# Altium project 110-00315-D_B1-DevKit_1.PrjPcb (part 4 of 5)

## Sheet 12-JLINK_1.SchDoc: B1 DevKit (DK-B1)
size 431 x 279 mm; Organization: ORGANIZATION; Address1: ADDRESS 1; Address2: ADDRESS 2; Address3: ADDRESS 3; Address4: ADDRESS 4; DocumentNumber: 12; Revision: -; SheetNumber: 12; SheetTotal: 14; ENG_APP_DATE: --/--/--; DSN_APP_DATE: --/--/--; CHK_APP_DATE: --/--/--
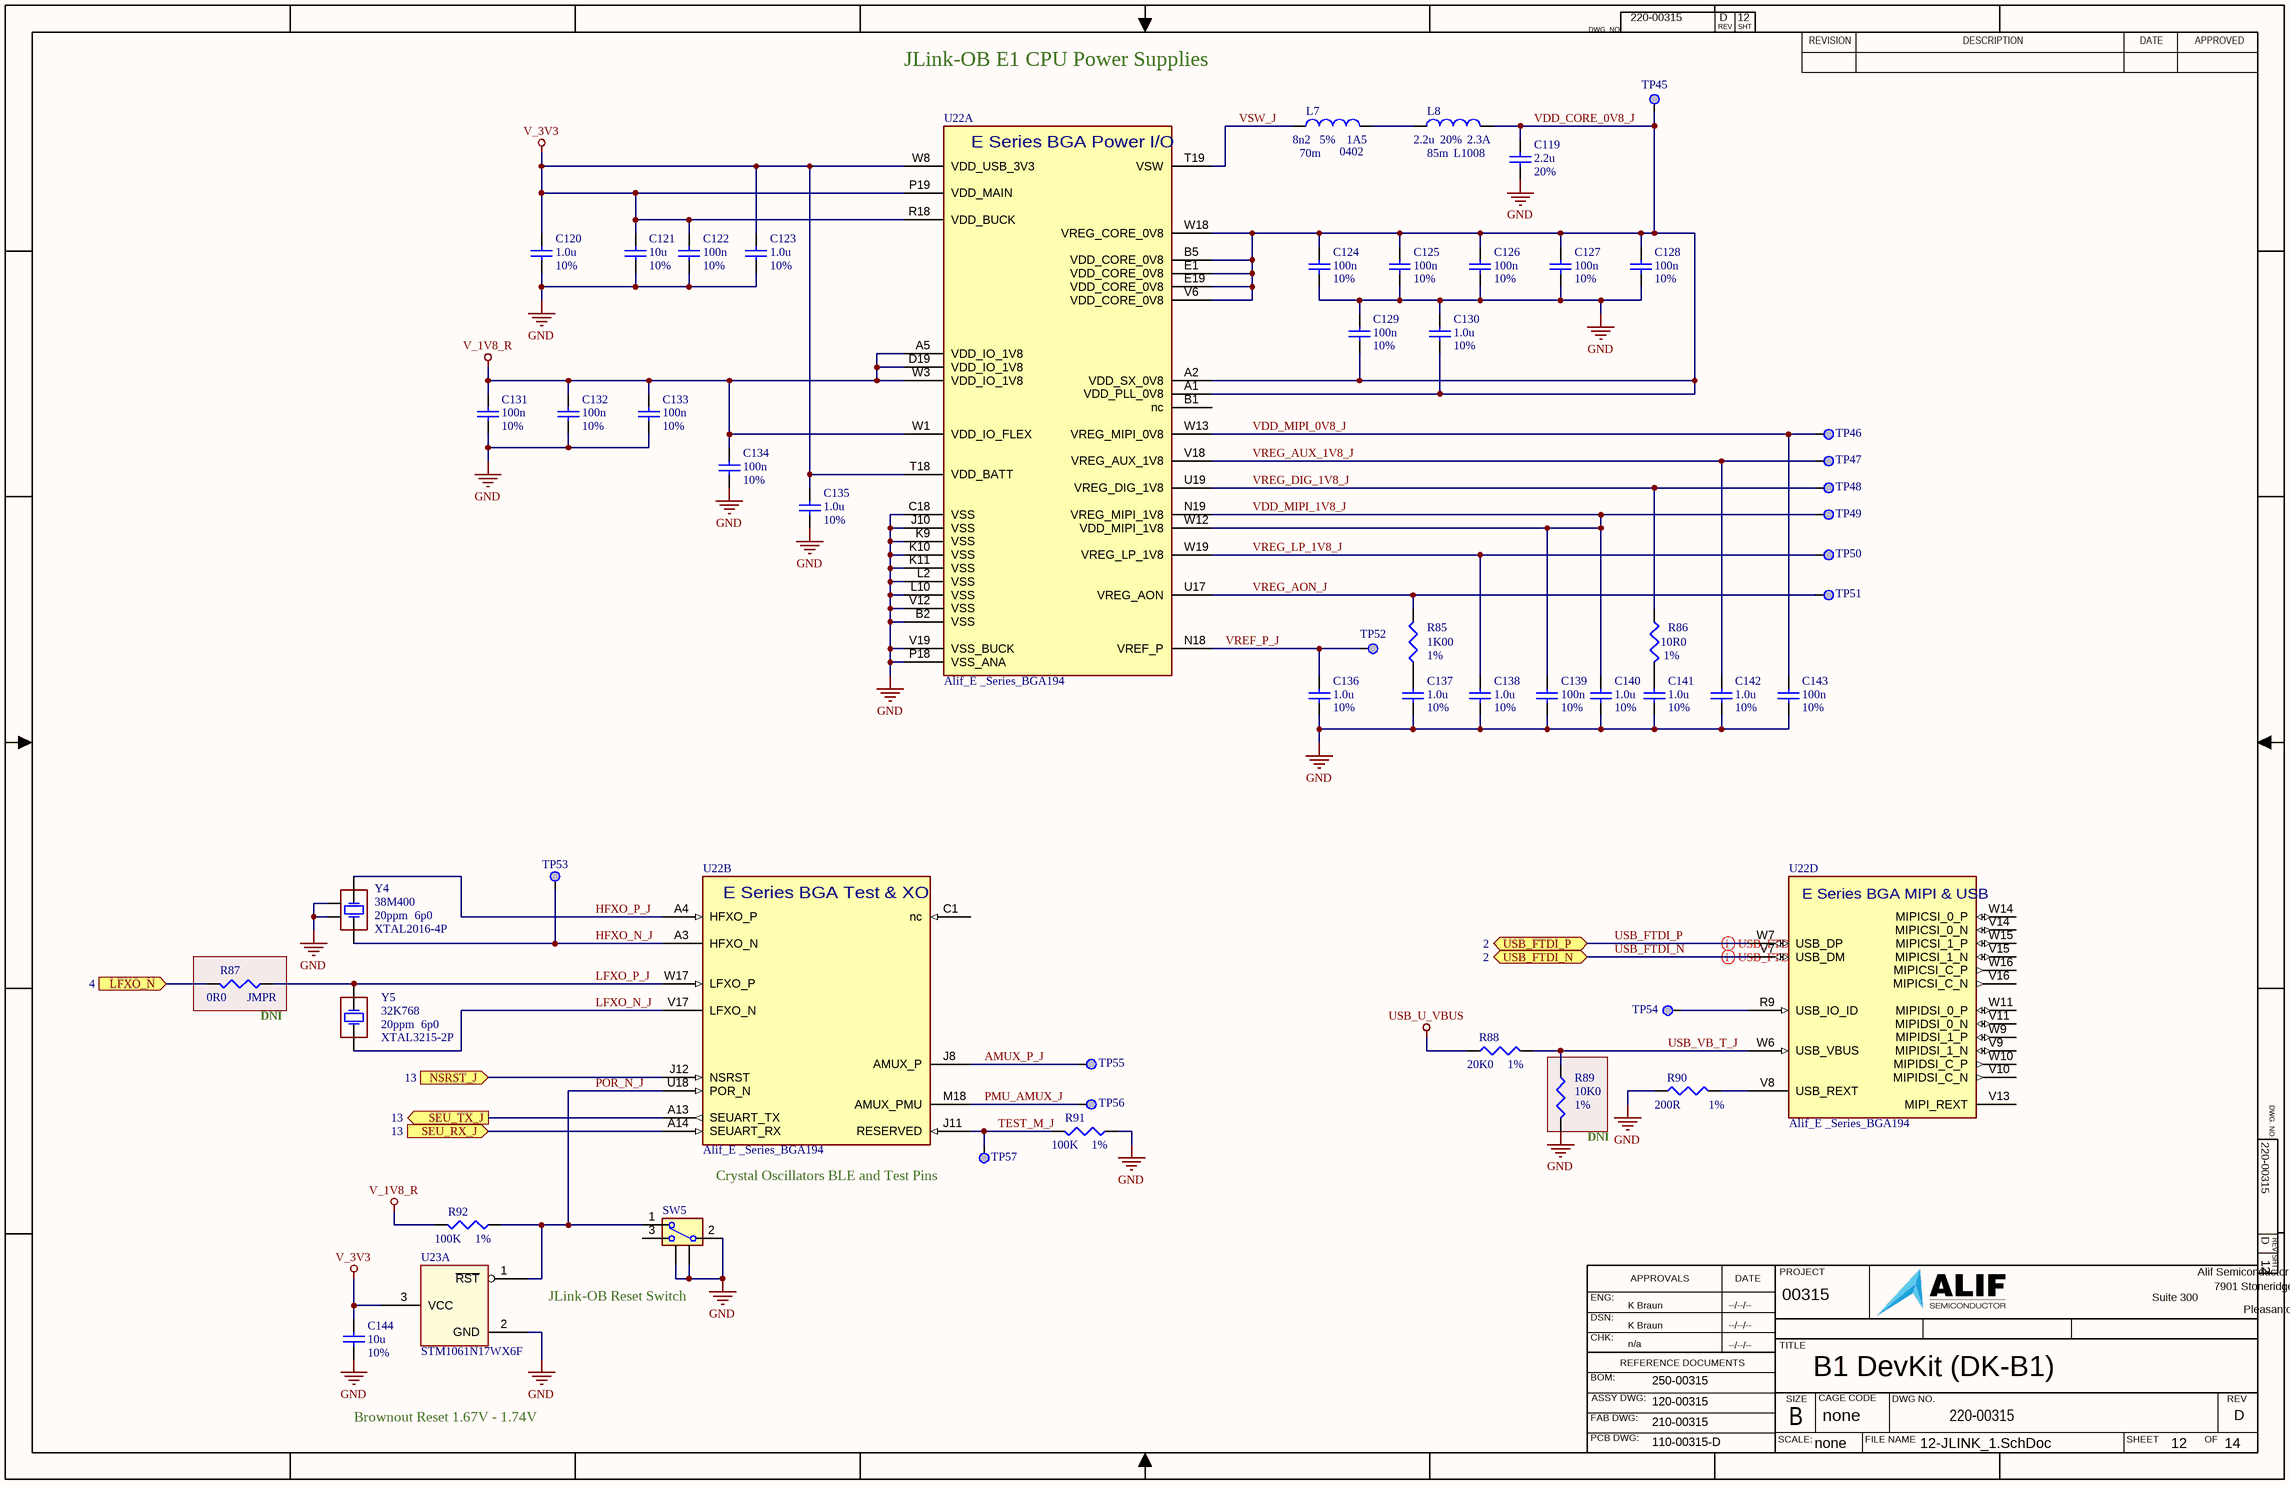
[diagram p11: 12-JLINK_1.SchDoc]

### Parts
C119  value 2.2u  Tolerance: 20%  [CAPC0402-01]  (hidden comment: Cap_225M25VX5R0402_1)
C120  value 1.0u  Tolerance: 10%  [CAPC0402-01]  (hidden comment: Cap)
C121  value 10u  Tolerance: 10%  [CAPC0402-01]  (hidden comment: Cap)
C122  value 100n  Tolerance: 10%  [CAPC0402-01]  (hidden comment: Cap)
C123  value 1.0u  Tolerance: 10%  [CAPC0402-01]  (hidden comment: Cap)
C124  value 100n  Tolerance: 10%  [CAPC0402-01]  (hidden comment: Cap)
C125  value 100n  Tolerance: 10%  [CAPC0402-01]  (hidden comment: Cap)
C126  value 100n  Tolerance: 10%  [CAPC0402-01]  (hidden comment: Cap)
C127  value 100n  Tolerance: 10%  [CAPC0402-01]  (hidden comment: Cap)
C128  value 100n  Tolerance: 10%  [CAPC0402-01]  (hidden comment: Cap)
C129  value 100n  Tolerance: 10%  [CAPC0402-01]  (hidden comment: Cap)
C130  value 1.0u  Tolerance: 10%  [CAPC0402-01]  (hidden comment: Cap)
C131  value 100n  Tolerance: 10%  [CAPC0402-01]  (hidden comment: Cap)
C132  value 100n  Tolerance: 10%  [CAPC0402-01]  (hidden comment: Cap)
C133  value 100n  Tolerance: 10%  [CAPC0402-01]  (hidden comment: Cap)
C134  value 100n  Tolerance: 10%  [CAPC0402-01]  (hidden comment: Cap)
C135  value 1.0u  Tolerance: 10%  [CAPC0402-01]  (hidden comment: Cap)
C136  value 1.0u  Tolerance: 10%  [CAPC0402-01]  (hidden comment: Cap)
C137  value 1.0u  Tolerance: 10%  [CAPC0402-01]  (hidden comment: Cap)
C138  value 1.0u  Tolerance: 10%  [CAPC0402-01]  (hidden comment: Cap)
C139  value 100n  Tolerance: 10%  [CAPC0402-01]  (hidden comment: Cap)
C140  value 1.0u  Tolerance: 10%  [CAPC0402-01]  (hidden comment: Cap)
C141  value 1.0u  Tolerance: 10%  [CAPC0402-01]  (hidden comment: Cap)
C142  value 1.0u  Tolerance: 10%  [CAPC0402-01]  (hidden comment: Cap)
C143  value 100n  Tolerance: 10%  [CAPC0402-01]  (hidden comment: Cap)
C144  value 10u  Tolerance: 10%  [CAPC0402-01]  (hidden comment: Cap)
L7  value 8n2  PCB_Footprint: 0402  DCR: 70m  RMS_Current: 1A5  Tolerance: 5%  [IND_WE-KI_0402]  (hidden comment: Inductor)
L8  value 2.2u  PackageReference: L1008  DCR: 85m  RMS_Current: 2.3A  Tolerance: 20%  [INDC2520X120N]  (hidden comment: Inductor)
R85  value 1K00  Tolerance: 1%  [RESC0402-01]  (hidden comment: Res3)
R86  value 10R0  Tolerance: 1%  [RESC0402-01]  (hidden comment: Res3)
R87  value 0R0  Tolerance: JMPR  [RESC0402-01]  (hidden comment: Res3)
R88  value 20K0  Tolerance: 1%  [RESC0402-01]  (hidden comment: Res3)
R89  value 10K0  Tolerance: 1%  [RESC0402-01]  (hidden comment: Res3)
R90  value 200R  Tolerance: 1%  [RESC0402-01]  (hidden comment: Res3)
R91  value 100K  Tolerance: 1%  [RESC0402-01]  (hidden comment: Res3)
R92  value 100K  Tolerance: 1%  [RESC0402-01]  (hidden comment: Res3)
SW5  SPDT  [SW_SPDT_OS10201MSQN1]  (value not drawn)
TP45  TP_SMPAD  [TP_30_RND]  (value not drawn)  (no BOM)
TP46  TP_SMPAD  [TP_30_RND]  (value not drawn)  (no BOM)
TP47  TP_SMPAD  [TP_30_RND]  (value not drawn)  (no BOM)
TP48  TP_SMPAD  [TP_30_RND]  (value not drawn)  (no BOM)
TP49  TP_SMPAD  [TP_30_RND]  (value not drawn)  (no BOM)
TP50  TP_SMPAD  [TP_30_RND]  (value not drawn)  (no BOM)
TP51  TP_SMPAD  [TP_30_RND]  (value not drawn)  (no BOM)
TP52  TP_SMPAD  [TP_30_RND]  (value not drawn)  (no BOM)
TP53  TP_SMPAD  [TP_30_RND]  (value not drawn)  (no BOM)
TP54  TP_SMPAD  [TP_30_RND]  (value not drawn)  (no BOM)
TP55  TP_SMPAD  [TP_30_RND]  (value not drawn)  (no BOM)
TP56  TP_SMPAD  [TP_30_RND]  (value not drawn)  (no BOM)
TP57  TP_SMPAD  [TP_30_RND]  (value not drawn)  (no BOM)
U22  Alif_E _Series_BGA194  [BGA194 _CENTERED]  (parts A,B,D of 4)
U23  STM1061N17WX6F  [SOT-23_DBZ_TEX]  (part A of 2)
Y4  value 38M400  PCB_Footprint: XTAL2016-4P  PPM: 20ppm  Load Cap: 6p0  [OSC_4p_2016_XRCGB38M400F2P00R0]  (hidden comment: Xtal_38M4_20PPM6PF_2016-4P_1)
Y5  value 32K768  PCB_Footprint: XTAL3215-2P  PPM: 20ppm  Load Cap: 6p0  [XTAL_ABS07_ABR-M]  (hidden comment: Xtal_32K768_20PPM6PF_3215-2P_1)

### Ports
LFXO_N (in, see 4), NSRST_J (in, see 13), SEU_RX_J (in, see 13), SEU_TX_J (out, see 13), USB_FTDI_N (bidir, see 2), USB_FTDI_P (bidir, see 2)

### Nets
GND: C119.1 C120.1 C121.1 C122.1 C123.1 C124.1 C125.1 C126.1 C127.1 C128.1 C129.2 C130.2 C131.1 C132.1 C133.1 C134.1 C135.1 C136.1 C137.1 C138.1 C139.1 C140.1 C141.1 C142.1 C143.1 C144.1 R89.2 R90.1 R91.1 SW5.2(COMMON) SW5.4(G1) SW5.5(G2) U22.B2(VSS) U22.C18(VSS) U22.J10(VSS) U22.K9(VSS) U22.K10(VSS) U22.K11(VSS) U22.L2(VSS) U22.L10(VSS) U22.P18(VSS_ANA) U22.V12(VSS) U22.V19(VSS_BUCK) U23.2(GND) Y4.2 Y4.4
USB_U_VBUS: R88.1
V_1V8_R: C131.2 C132.2 C133.2 C134.2 R92.2 U22.A5(VDD_IO_1V8) U22.D19(VDD_IO_1V8) U22.W1(VDD_IO_FLEX) U22.W3(VDD_IO_1V8)
V_3V3: C120.2 C121.2 C122.2 C123.2 C135.2 C144.2 U22.P19(VDD_MAIN) U22.R18(VDD_BUCK) U22.T18(VDD_BATT) U22.W8(VDD_USB_3V3) U23.3(VCC)
AMUX_P_J: TP55.1 U22.J8(AMUX_P)
HFXO_N_J: TP53.1 U22.A3(HFXO_N) Y4.3(OSC2)
HFXO_P_J: U22.A4(HFXO_P) Y4.1(OSC1)
LFXO_N: R87.2 ; port LFXO_N
LFXO_N_J: U22.V17(LFXO_N) Y5.1(OSC1)
LFXO_P_J: R87.1 U22.W17(LFXO_P) Y5.2(OSC2)
NSRST_J: U22.J12(NSRST) ; port NSRST_J
PMU_AMUX_J: TP56.1 U22.M18(AMUX_PMU)
POR_N_J: R92.1 SW5.1(NC) U22.U18(POR_N) U23.1(~{RST})
SEUART_RX_J: U22.A14(SEUART_RX) ; port SEU_RX_J
SEUART_TX_J: U22.A13(SEUART_TX) ; port SEU_TX_J
TEST_M_J: R91.2 TP57.1 U22.J11(RESERVED)
USB_FTDI_N: U22.V7(USB_DM) ; port USB_FTDI_N
USB_FTDI_P: U22.W7(USB_DP) ; port USB_FTDI_P
USB_VB_T_J: R88.2 R89.1 U22.W6(USB_VBUS)
VDD_CORE_0V8_J: C119.2 C124.2 C125.2 C126.2 C127.2 C128.2 C129.1 C130.1 L8.2 TP45.1 U22.A1(VDD_PLL_0V8) U22.A2(VDD_SX_0V8) U22.B5(VDD_CORE_0V8) U22.E1(VDD_CORE_0V8) U22.E19(VDD_CORE_0V8) U22.V6(VDD_CORE_0V8) U22.W18(VREG_CORE_0V8)
VDD_MIPI_0V8_J: C143.2 TP46.1 U22.W13(VREG_MIPI_0V8)
VDD_MIPI_1V8_J: C139.2 C140.2 TP49.1 U22.N19(VREG_MIPI_1V8) U22.W12(VDD_MIPI_1V8)
VREF_P_J: C136.2 TP52.1 U22.N18(VREF_P)
VREG_AON_J: R85.2 TP51.1 U22.U17(VREG_AON)
VREG_AUX_1V8_J: C142.2 TP47.1 U22.V18(VREG_AUX_1V8)
VREG_DIG_1V8_J: R86.2 TP48.1 U22.U19(VREG_DIG_1V8)
VREG_LP_1V8_J: C138.2 TP50.1 U22.W19(VREG_LP_1V8)
VSW_J: L7.1 U22.T19(VSW)
NetC137_2: C137.2 R85.1
NetC141_2: C141.2 R86.1
NetL7_2: L7.2 L8.1
NetR90_2: R90.2 U22.V8(USB_REXT)
NetTP54_1: TP54.1 U22.R9(USB_IO_ID)

Not connected (* = marked no-connect by the designer): SW5 3(NO); U22 B1(nc) C1(nc) V9(MIPIDSI_1_N) V10(MIPIDSI_C_N) V11(MIPIDSI_0_N) V13(MIPI_REXT) V14(MIPICSI_0_N) V15(MIPICSI_1_N) V16(MIPICSI_C_N) W9(MIPIDSI_1_P) W10(MIPIDSI_C_P) W11(MIPIDSI_0_P) W14(MIPICSI_0_P) W15(MIPICSI_1_P) W16(MIPICSI_C_P)

### Layout directives
differential pair; differential pair class USB_: USB_FTDI_N, USB_FTDI_P

### Notes on the sheet
- JLink-OB E1 CPU Power Supplies
- (near R87) DNI
- (near R89) DNI
- (near TP57) Crystal Oscillators BLE and Test Pins
- JLink-OB Reset Switch
- Brownout Reset 1.67V - 1.74V
- DWG. NO.
- REV
- SHT
- REVISION
- DESCRIPTION
- DATE
- APPROVED
- ENG:
- APPROVALS
- PROJECT
- Suite 300
- Alif Semiconductor
- 7901 Stoneridge Drive
- DSN:
- CHK:
- REFERENCE DOCUMENTS
- TITLE
- Pleasanton, CA 94588  USA
- BOM:
- FAB DWG:
- PCB DWG:
- ASSY DWG:
- SCALE:
- SIZE
- B
- CAGE CODE
- FILE NAME
- DWG NO.
- SHEET
- OF
- none
- (in symbol E7_B0_194BGA, part A) E Series BGA Power I/O
- (in symbol E7_B0_194BGA, part B) E Series BGA Test & XO
- (in symbol E7_B0_194BGA, part D) E Series BGA MIPI & USB

### Library data of the parts
C119 = Cap_225M25VX5R0402_1: as C85 on sheet 8-SensorsAndJTAG; Published: 8-Jun-2000; LatestRevisionDate: 17-Jul-2002; LatestRevisionNote: Re-released for DXP Platform.; PackageReference: RAD-0.3; Publisher: Altium Limited; PackageDescription: Radial Cap, Thru-Hole; 2 Leads; 0.3 in Pin Spacing; Max_Height: 0.60mm; Type: X5R; Voltage: 25V; Manufacturer 2: Murata; Manufacturer Part Number 2: GRM155R61E225ME11D; Manufacturer 3: Murata; Manufacturer Part Number 3: GRM155R61E225ME15D
C120 C123 C130 C135-C138 C140-C142 = Cap: as C110 on sheet 10-Click; Published: 8-Jun-2000; LatestRevisionDate: 17-Jul-2002; LatestRevisionNote: Re-released for DXP Platform.; PackageReference: RAD-0.3; Publisher: Altium Limited; PackageDescription: Radial Cap, Thru-Hole; 2 Leads; 0.3 in Pin Spacing; Max_Height: 0.60mm; Manufacturer 2: Yageo; Manufacturer Part Number 2: CC0402KRX5R8BB105; Manufacturer 3: Murata; Manufacturer Part Number 3: GRM155R61E105KA12D; Type: X5R; Voltage: 25V
C121 C144 = Cap: as C96 on sheet 9-MIPI; Published: 8-Jun-2000; LatestRevisionDate: 17-Jul-2002; LatestRevisionNote: Re-released for DXP Platform.; PackageReference: RAD-0.3; Publisher: Altium Limited; PackageDescription: Radial Cap, Thru-Hole; 2 Leads; 0.3 in Pin Spacing; Max_Height: 0.60mm; Manufacturer 2: Samsung; Manufacturer Part Number 2: CL05A106MP5NUNC; Manufacturer 3: Venkel; Manufacturer Part Number 3: C0402X5R100-106MNP; Type: X5R; Voltage: 10V
C122 C124-C129 C131-C134 C139 C143 = Cap: as C77-C82 on sheet 7-IO_Headers; Published: 8-Jun-2000; LatestRevisionDate: 17-Jul-2002; LatestRevisionNote: Re-released for DXP Platform.; PackageReference: RAD-0.3; Publisher: Altium Limited; PackageDescription: Radial Cap, Thru-Hole; 2 Leads; 0.3 in Pin Spacing; Max_Height: 0.60mm; Manufacturer 2: Samsung; Manufacturer Part Number 2: CL05B104KB54PNC; Manufacturer 3: Walsin; Manufacturer Part Number 3: 0402B104K500CT; Type: X7R; Voltage: 50V
L7 = Inductor: Ind,Unshielded,8.2nH,<5%,1.5A,<70mOhm, SRF > 4GHz, 0402; Manufacturer 1: Delta; Manufacturer Part Number 1: 0402HP-8N2EGTS; Published: 8-Jun-2000; LatestRevisionDate: 29-May-2009; LatestRevisionNote: IPC-7351 Footprint Added.; PackageReference: 0402; Publisher: Altium Limited; PackageDescription: Chip Inductor; Code_JEITA: 0402; Code_IEC: 0402; Sat_Current: *; Impedance: *; Type: *; Manufacturer 2: MuRata; Manufacturer Part Number 2: LQW15AN8N2G80D; Manufacturer 3: CoilCraft; Manufacturer Part Number 3: 0402DC-8N2XGRW; Max_Height: 0.70mm
L8 = Inductor: Ind,Unshielded,2.2uH,20%,2.3A,85mOhm,1008(2520); Manufacturer 1: MuRata; Manufacturer Part Number 1: DFE252012F-2R2M=P2; Code_IEC: 2520; Published: 8-Jun-2000; LatestRevisionDate: 29-May-2009; LatestRevisionNote: IPC-7351 Footprint Added.; Publisher: Altium Limited; PackageDescription: Chip Inductor; Code_JEITA: 2520; Sat_Current: *; Impedance: *; Type: *; Manufacturer 2: Pulse Eng; Manufacturer Part Number 2: BDHE002520122R2MQ1; Manufacturer 3: Vishay; Manufacturer Part Number 3: IHHP1008ABER2R2M01; Max_Height: 0.60mm; PCB_Footprint: L1008
R85 = Res3: Res,1K00,1%,100ppm,0402; Manufacturer 1: Stackpol; Manufacturer Part Number 1: RMCF0402FT1K; Wattage: 63mW; Published: 8-Jun-2000; LatestRevisionDate: 29-May-2009; LatestRevisionNote: IPC-7351 Footprint Added.; PackageReference: RESC0402-01; Publisher: Altium Limited; PackageDescription: Chip Resistor; Voltage: *; Type: Thick Film; Manufacturer 2: Yageo; Manufacturer Part Number 2: RC0402FR-071KL; Manufacturer 3: Bourns; Manufacturer Part Number 3: CR0402-FX-1001GLF; PCB_Footprint: RESC0402-01
R86 = Res3: Res,10R0,1%,100ppm,0402; Manufacturer 1: Vishay; Manufacturer Part Number 1: CRCW040210R0FKED; Wattage: 63mW; Published: 8-Jun-2000; LatestRevisionDate: 29-May-2009; LatestRevisionNote: IPC-7351 Footprint Added.; PackageReference: RESC0402-01; Publisher: Altium Limited; PackageDescription: Chip Resistor; Voltage: *; Type: Thick Film; Manufacturer 2: KOA; Manufacturer Part Number 2: RK73H1ETTP10R0F; Manufacturer 3: Stackpol; Manufacturer Part Number 3: RMCF0402FT10R0; PCB_Footprint: RESC0402-01
R87 = Res3: DNI,Res,0R ohm,Jumper,0402; Manufacturer 1: Stackpol; Manufacturer Part Number 1: RMCF0402ZT0R00; Wattage: 63mW; Published: 8-Jun-2000; LatestRevisionDate: 29-May-2009; LatestRevisionNote: IPC-7351 Footprint Added.; PackageReference: RESC0402-01; Publisher: Altium Limited; PackageDescription: Chip Resistor; Voltage: *; Type: Thick Film; Manufacturer 2: Yageo; Manufacturer Part Number 2: RC0402FR-070RL; Manufacturer 3: Panasonic; Manufacturer Part Number 3: ERJ-XGN0R00Y; PCB_Footprint: RESC0402-01
R88 = Res3: as R51 on sheet 8-SensorsAndJTAG; Published: 8-Jun-2000; LatestRevisionDate: 29-May-2009; LatestRevisionNote: IPC-7351 Footprint Added.; PackageReference: RESC0402-01; Publisher: Altium Limited; PackageDescription: Chip Resistor; Voltage: *; Type: Thick Film; Manufacturer 2: Yageo; Manufacturer Part Number 2: RC0402FR-0720KL; Manufacturer 3: Bourns; Manufacturer Part Number 3: CR0402-FX-2002GLF; PCB_Footprint: RESC0402-01
R89 = Res3: DNI,Res,10K0,1%,100ppm,0402; Manufacturer 1: Stackpol; Manufacturer Part Number 1: RMCF0402FT10K0; Wattage: 63mW; Published: 8-Jun-2000; LatestRevisionDate: 29-May-2009; LatestRevisionNote: IPC-7351 Footprint Added.; PackageReference: RESC0402-01; Publisher: Altium Limited; PackageDescription: Chip Resistor; Voltage: *; Type: Thick Film; Manufacturer 2: Yageo; Manufacturer Part Number 2: RC0402FR-0710KL; Manufacturer 3: Bourns; Manufacturer Part Number 3: CR0402-FX-1002GLF; PCB_Footprint: RESC0402-01
R90 = Res3: Res,200R,1%,100ppm,0402; Manufacturer 1: Stackpol; Manufacturer Part Number 1: RMCF0402FT220R; Wattage: 63mW; Published: 8-Jun-2000; LatestRevisionDate: 29-May-2009; LatestRevisionNote: IPC-7351 Footprint Added.; PackageReference: RESC0402-01; Publisher: Altium Limited; PackageDescription: Chip Resistor; Voltage: *; Type: Thick Film; Manufacturer 2: Yageo; Manufacturer Part Number 2: RC0402FR-07200RL; Manufacturer 3: Bourns; Manufacturer Part Number 3: CR0402-FX-2000GLF; PCB_Footprint: RESC0402-01
R91 R92 = Res3: as R49 on sheet 8-SensorsAndJTAG; Published: 8-Jun-2000; LatestRevisionDate: 29-May-2009; LatestRevisionNote: IPC-7351 Footprint Added.; PackageReference: RESC0402-01; Publisher: Altium Limited; PackageDescription: Chip Resistor; Voltage: *; Type: Thick Film; Manufacturer 2: Yageo; Manufacturer Part Number 2: RC0402FR-07100KL; Manufacturer 3: Bourns; Manufacturer Part Number 3: CR0402-FX-1003GLF; PCB_Footprint: RESC0402-01
SW5 = SW-SPDT_Vert-5P: Switch,SPDT, 12V, 50mA, Non-Shorting, 5 Pin PCB Vertical; Manufacturer 1: C&K; Manufacturer Part Number 1: OS102011MS2QN1; Value: SPDT-5Pin; Published: 24-Mar-1999; LatestRevisionDate: 17-Jul-2002; LatestRevisionNote: Re-released for DXP Platform.; PackageReference: SPDT-5; Publisher: Altium Limited; PackageDescription: Switch; 2 Leads; Manufacturer 2: C&K; Manufacturer Part Number 2: OS102011MS2QN1C; Manufacturer 3: E-Switch; Manufacturer Part Number 3: EG1249
TP45-TP57 = TP_SMPAD: as TP34-TP39 on sheet 9-MIPI
U22 = E7_B0_194BGA: IC,Alif E1 MCU, Rev B silicon,BGA194; Manufacturer 1: Alif Semi; Manufacturer Part Number 1: AE101F4071542LH
U23 = IC_SUP_STM1061N17WX6F: IC,PMIC Volt Supervisor, -Reset OD, 1.7V, 2%, 900nA, SOT23-3; Manufacturer 1: ST Micro; Manufacturer Part Number 1: STM1061N17WX6F; Manufacturer 2: *; Manufacturer Part Number 2: *
Y4 = Xtal_38M4_20PPM6PF_2016-4P_1: Crystal,38.4MHz,20ppm,6.0pF,100ohm,2016-4pin; Manufacturer 1: Murata; Manufacturer Part Number 1: XRCGB38M400F2P00R0; ESR: 100; Published: 8-Jun-2000; LatestRevisionDate: 17-Jul-2002; LatestRevisionNote: Re-released for DXP Platform.; PackageReference: R38; Publisher: Altium Limited; PackageDescription: Crystal, Thru-Hole; 2 Leads; Body 3.1 x 8.2 mm (Dia.xH); Max_Height: 0.65mm
Y5 = Xtal_32K768_20PPM6PF_3215-2P_1: Crystal, 32.768KHz, 20ppm, 6pF, <70Kohm, 3215-2pin; Manufacturer 1: Epson; Manufacturer Part Number 1: FC-135R 32.7680KF-E; ESR: 70Kohm; Published: 8-Jun-2000; LatestRevisionDate: 17-Jul-2002; LatestRevisionNote: Re-released for DXP Platform.; PackageReference: R38; Publisher: Altium Limited; PackageDescription: Crystal, Thru-Hole; 2 Leads; Body 3.1 x 8.2 mm (Dia.xH); Max_Height: 0.60mm; Manufacturer 2: Abracon; Manufacturer Part Number 2: ABS07-32.768KHZ-6-T

## Sheet 13-JLINK_2.SchDoc: B1 DevKit (DK-B1)
size 431 x 279 mm; Organization: ORGANIZATION; Address1: ADDRESS 1; Address2: ADDRESS 2; Address3: ADDRESS 3; Address4: ADDRESS 4; DocumentNumber: 13; Revision: -; SheetNumber: 13; SheetTotal: 14; ENG_APP_DATE: --/--/--; DSN_APP_DATE: --/--/--; CHK_APP_DATE: --/--/--
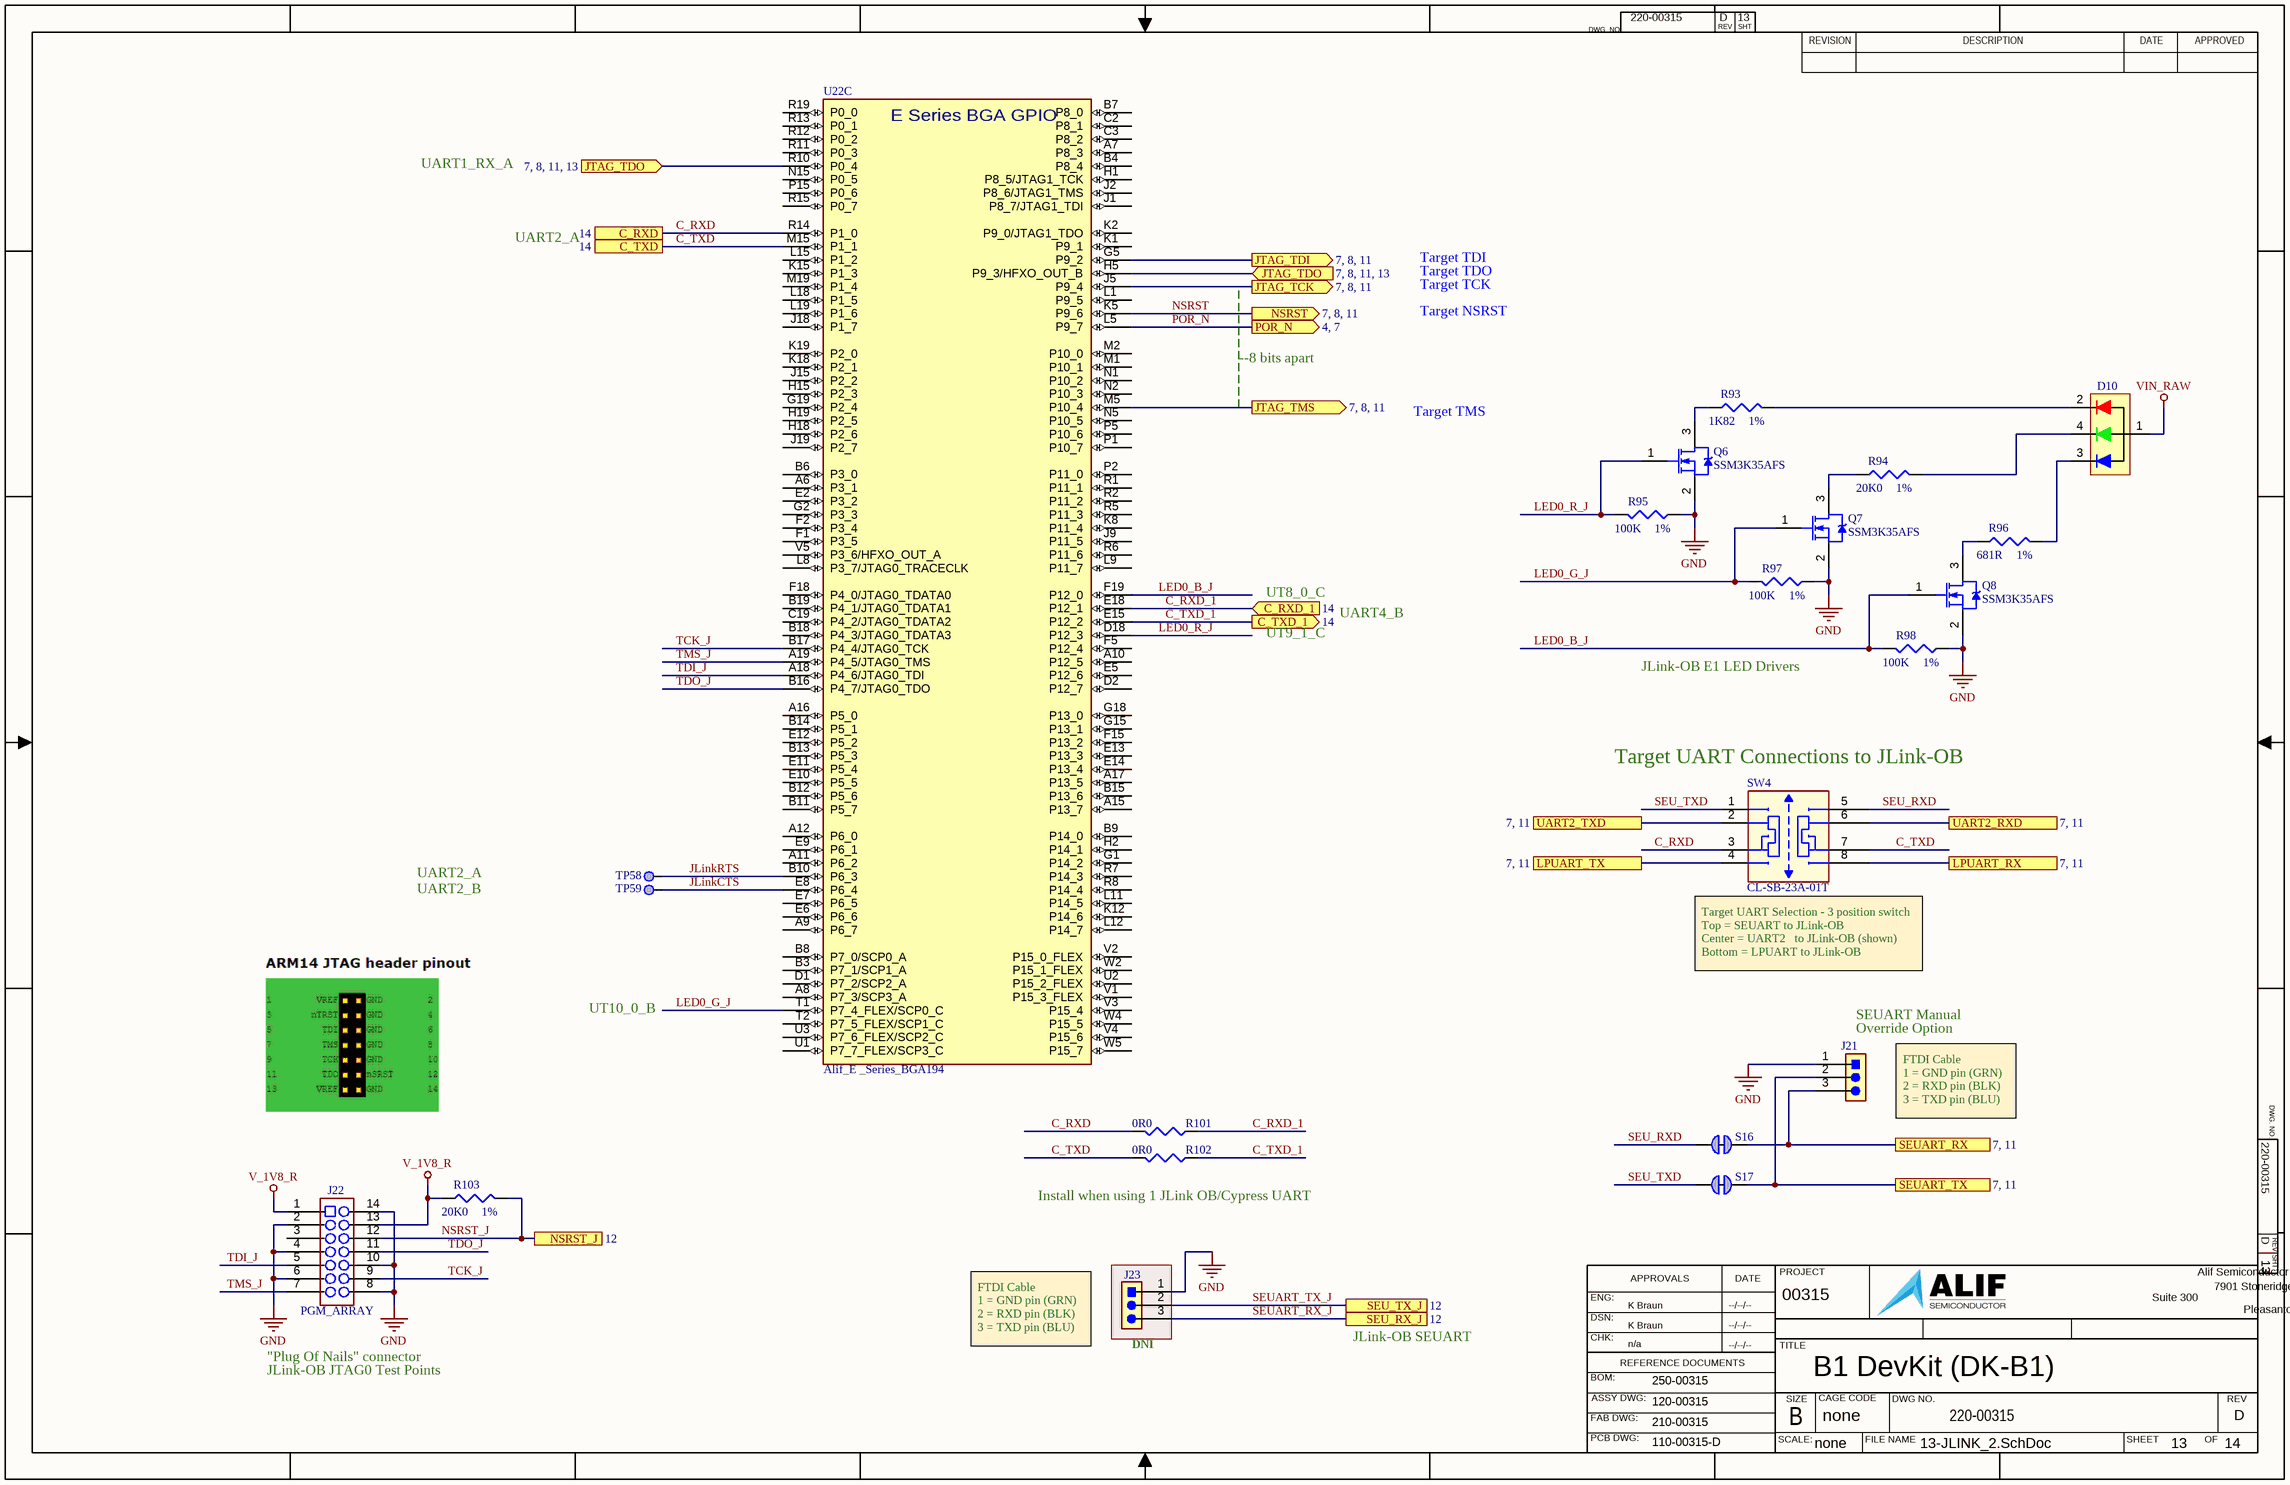
[diagram p12: 13-JLINK_2.SchDoc]

### Parts
D10  SML-LX0404SIUPGUSB  [LED_SML-LX0404_LUM]  (value not drawn)
J21  TSW-103-07-G-S  [CONN_HDR_1X3_STRT_0.100_no3D]  (value not drawn)
J22  value PGM_ARRAY  [TC2070-IDC]  (hidden comment: PGMG_CONTACT,14P,TC2070-IDC_1)  (no BOM)
J23  TSW-103-07-G-S  [CONN_HDR_1X3_STRT_0.100_no3D]  (value not drawn)
Q6  Manufacturer Part Number 1: SSM3K35AFS  [SC75_SSM_TOS-L]  (hidden comment: NMOS-2_SOT)
Q7  Manufacturer Part Number 1: SSM3K35AFS  [SC75_SSM_TOS-L]  (hidden comment: NMOS-2_SOT)
Q8  Manufacturer Part Number 1: SSM3K35AFS  [SC75_SSM_TOS-L]  (hidden comment: NMOS-2_SOT)
R93  value 1K82  Tolerance: 1%  [RESC0402-01]  (hidden comment: Res3)
R94  value 20K0  Tolerance: 1%  [RESC0402-01]  (hidden comment: Res3)
R95  value 100K  Tolerance: 1%  [RESC0402-01]  (hidden comment: Res3)
R96  value 681R  Tolerance: 1%  [RESC0402-01]  (hidden comment: Res3)
R97  value 100K  Tolerance: 1%  [RESC0402-01]  (hidden comment: Res3)
R98  value 100K  Tolerance: 1%  [RESC0402-01]  (hidden comment: Res3)
R101  value 0R0  [RESC0402-01]  (hidden comment: Res3)
R102  value 0R0  [RESC0402-01]  (hidden comment: Res3)
R103  value 20K0  Tolerance: 1%  [RESC0402-01]  (hidden comment: Res3)
S16  SolderJumperShorted_Small  [Solderbridge_Shorted]  (value not drawn)  (net tie, no BOM)
S17  SolderJumperShorted_Small  [Solderbridge_Shorted]  (value not drawn)  (net tie, no BOM)
SW4  CL-SB-23A-01T  [SW_CL-SB-23A-01_NDC-M]
TP58  TP_SMPAD  [TP_30_RND]  (value not drawn)  (no BOM)
TP59  TP_SMPAD  [TP_30_RND]  (value not drawn)  (no BOM)
U22  Alif_E _Series_BGA194  [BGA194 _CENTERED]  (part C of 4)

### Ports
C_RXD (see 14), C_RXD_1 (in, see 14), C_TXD (see 14), C_TXD_1 (out, see 14), JTAG_TCK (out, see 7, 8, 11), JTAG_TDI (out, see 7, 8, 11), JTAG_TDO (in, see 7, 8, 11, 13), JTAG_TMS (out, see 7, 8, 11), LPUART_RX (see 7, 11), LPUART_TX (see 7, 11), NSRST (out, see 7, 8, 11), NSRST_J (see 12), POR_N (out, see 4, 7), SEU_RX_J (see 12), SEU_TX_J (see 12), SEUART_RX (see 7, 11), SEUART_TX (see 7, 11), UART2_RXD (see 7, 11), UART2_TXD (see 7, 11)

### Nets
GND: J21.1 J22.2 J22.4 J22.6 J22.8 J22.10 J22.14 J23.1 Q6.2(S) Q7.2(S) Q8.2(S) R95.1 R97.1 R98.1
V_1V8_R: J22.1 J22.13 R103.1
VIN_RAW: D10.1(A)
C_RXD: R101.2 SW4.3(CA) U22.R14(P1_0) ; port C_RXD
C_RXD_1: R101.1 U22.E18(P12_1) ; port C_RXD_1
C_TXD: R102.2 SW4.7(2B) U22.M15(P1_1) ; port C_TXD
C_TXD_1: R102.1 U22.E15(P12_2) ; port C_TXD_1
JLinkCTS: TP59.1 U22.E8(P6_4)
JLinkRTS: TP58.1 U22.B10(P6_3)
LED0_B_J: Q8.1(G) R98.2 U22.F19(P12_0)
LED0_G_J: Q7.1(G) R97.2 U22.T1(P7_4_FLEX/SCP0_C)
LED0_R_J: Q6.1(G) R95.2 U22.D18(P12_3)
NSRST: U22.K5(P9_6) ; port NSRST
NSRST_J: J22.12 R103.2 ; port NSRST_J
P0_0: J21.3 S16.2 ; port SEUART_RX
P0_1: J21.2 S17.2 ; port SEUART_TX
P0_7: U22.J5(P9_4) ; port JTAG_TCK
P1_0: U22.M5(P10_4) ; port JTAG_TMS
P1_1: U22.G5(P9_2) ; port JTAG_TDI
P1_2: U22.H5(P9_3/HFXO_OUT_B) U22.R10(P0_4) ; port JTAG_TDO
P2_0: SW4.8(1B) ; port LPUART_RX
P5_2: SW4.6(CB) ; port UART2_RXD
P5_3: SW4.2(2A) ; port UART2_TXD
P7_1: SW4.4(3A) ; port LPUART_TX
POR_N: U22.L5(P9_7) ; port POR_N
SEU_RXD: S16.1 SW4.5(3B)
SEU_TXD: S17.1 SW4.1(1A)
SEUART_RX_J: J23.3 ; port SEU_RX_J
SEUART_TX_J: J23.2 ; port SEU_TX_J
TCK_J: J22.9 U22.B17(P4_4/JTAG0_TCK)
TDI_J: J22.5 U22.A18(P4_6/JTAG0_TDI)
TDO_J: J22.11 U22.B16(P4_7/JTAG0_TDO)
TMS_J: J22.7 U22.A19(P4_5/JTAG0_TMS)
NetD10_2: D10.2(RK) R93.2
NetD10_3: D10.3(BK) R96.2
NetD10_4: D10.4(GK) R94.2
NetQ6_3: Q6.3(D) R93.1
NetQ7_3: Q7.3(D) R94.1
NetQ8_3: Q8.3(D) R96.1

Not connected (* = marked no-connect by the designer): J22 3; U22 A6(P3_1) A7(P8_3) A8(P7_3/SCP3_A) A9(P6_7) A10(P12_5) A11(P6_2) A12(P6_0) A15(P13_7) A16(P5_0) A17(P13_5) B3(P7_1/SCP1_A) B4(P8_4) B6(P3_0) B7(P8_0) B8(P7_0/SCP0_A) B9(P14_0) B11(P5_7) B12(P5_6) B13(P5_3) B14(P5_1) B15(P13_6) B18(P4_3/JTAG0_TDATA3) B19(P4_1/JTAG0_TDATA1) C2(P8_1) C3(P8_2) C19(P4_2/JTAG0_TDATA2) D1(P7_2/SCP2_A) D2(P12_7) E2(P3_2) E5(P12_6) E6(P6_6) E7(P6_5) E9(P6_1) E10(P5_5) E11(P5_4) E12(P5_2) E13(P13_3) E14(P13_4) F1(P3_5) F2(P3_4) F5(P12_4) F15(P13_2) F18(P4_0/JTAG0_TDATA0) G1(P14_2) G2(P3_3) G15(P13_1) G18(P13_0) G19(P2_4) H1(P8_5/JTAG1_TCK) H2(P14_1) H15(P2_3) H18(P2_6) H19(P2_5) J1(P8_7/JTAG1_TDI) J2(P8_6/JTAG1_TMS) J9(P11_5) J15(P2_2) J18(P1_7) J19(P2_7) K1(P9_1) K2(P9_0/JTAG1_TDO) K8(P11_4) K12(P14_6) K15(P1_3) K18(P2_1) K19(P2_0) L1(P9_5) L8(P3_7/JTAG0_TRACECLK) L9(P11_7) L11(P14_5) L12(P14_7) L15(P1_2) L18(P1_5) L19(P1_6) M1(P10_1) M2(P10_0) M19(P1_4) N1(P10_2) N2(P10_3) N5(P10_5) N15(P0_5) P1(P10_7) P2(P11_0) P5(P10_6) P15(P0_6) R1(P11_1) R2(P11_2) R5(P11_3) R6(P11_6) R7(P14_3) R8(P14_4) R11(P0_3) R12(P0_2) R13(P0_1) R15(P0_7) R19(P0_0) T2(P7_5_FLEX/SCP1_C) U1(P7_7_FLEX/SCP3_C) U2(P15_2_FLEX) U3(P7_6_FLEX/SCP2_C) V1(P15_3_FLEX) V2(P15_0_FLEX) V3(P15_4) V4(P15_6) V5(P3_6/HFXO_OUT_A) W2(P15_1_FLEX) W4(P15_5) W5(P15_7)

### Notes on the sheet
- UART1_RX_A
- UART2_A
- Target TCK
- Target TDO
- Target TDI
- --8 bits apart
- Target NSRST
- Target TMS
- UT8_0_C
- UART4_B
- UT9_1_C
- JLink-OB E1 LED Drivers
- (near SW4) Target UART Connections to JLink-OB
- UART2_B
- (near SW4) Target UART Selection - 3 position switch
  Top = SEUART to JLink-OB
  Center = UART2   to JLink-OB (shown)
  Bottom = LPUART to JLink-OB
- UT10_0_B
- (near J21) SEUART Manual
- (near J21) Override Option
- FTDI Cable
  1 = GND pin (GRN)
  2 = RXD pin (BLK)
  3 = TXD pin (BLU)
- (near R102) Install when using 1 JLink OB/Cypress UART
- JLink-OB JTAG0 Test Points
- "Plug Of Nails" connector
- (near J23) DNI
- JLink-OB SEUART
- DWG. NO.
- REV
- SHT
- REVISION
- DESCRIPTION
- DATE
- APPROVED
- ENG:
- APPROVALS
- PROJECT
- Suite 300
- Alif Semiconductor
- 7901 Stoneridge Drive
- DSN:
- CHK:
- REFERENCE DOCUMENTS
- TITLE
- Pleasanton, CA 94588  USA
- BOM:
- FAB DWG:
- PCB DWG:
- ASSY DWG:
- SCALE:
- SIZE
- B
- CAGE CODE
- FILE NAME
- DWG NO.
- SHEET
- OF
- none
- (in symbol E7_B0_194BGA, part C) E Series BGA GPIO

### Library data of the parts
D10 = D LED_RGB_CA_1MMc1MM: Diode,LED,RGB, (@2mA) -> R=10mcd & 1.75V, G = 50mcd & 2.75V, B = 20mcd & 2.95V, 0404(1mm x 1mm); Manufacturer 1: Lumex; Published: 8-Jun-2000; LatestRevisionDate: 17-Jul-2002; LatestRevisionNote: Re-released for DXP Platform.; PackageVersion: Feb-2002; PackageReference: 1.0x1.0; Publisher: Altium Limited; PackageDescription: SM LED; 2 Flat Leads; Manufacturer Part Number 1: SML-LX0404SIUPGUSB; Manufacturer 2: *; Manufacturer Part Number 2: *; Manufacturer 3: *; Manufacturer Part Number 3: *
J21 = Hdr_M_1X3_2M54_STRT_UNSHROUD: Hdr, 0.025" SQ Post Header, Through-hole, Vertical, -55 to 125 degC, 2.54 mm Pitch, 3-Pin, Male, RoHS; Manufacturer: Samtec; Manufacturer Part Number 1: TSW-103-07-L-S; Pitch: 2.54 mm; ComponentLink3URL: http://www.samtec.com/documents/webfiles/cpdf/TSW-XXX-XX-XXX-X-XX-XXX-MKT.pdf; Temperature Range: -55 to 125 degC; DatasheetVersion: F-214; ComponentLink1Description: Manufacturer URL; ComponentLink2URL: http://www.samtec.com/documents/webfiles/pdf/TSW_TH.PDF; RoHS: True; Orientation: Vertical; ComponentLink2Description: Datasheet; ComponentLink3Description: Package Specification; PackageDescription: .025[0.64] SQ. Post Terminal Strip Assembly; Mounting Technology: Through-hole; PackageVersion: DM, 8/1988; ComponentLink1URL: http://www.samtec.com; PackageReference: *; PartNumber: *; Manufacturer 1: Samtec; Manufacturer 2: Sullins; Manufacturer Part Number 2: PRPC003SAAN-RC; Manufacturer 3: 3M; Manufacturer Part Number 3: 929647-01-03-I
J22 = PGMG_CONTACT,14P,TC2070-IDC_1: Test Point, Array, Alignment Pins, SMT Pad,--not a BOM item--; Manufacturer 1: *; Manufacturer Part Number 1: *; PCB_Footprint: TC2070-IDC
J23 = Hdr_M_1X3_2M54_STRT_UNSHROUD: DNI, Hdr, 0.025" SQ Post Header, Through-hole, Vertical, -55 to 125 degC, 2.54 mm Pitch, 3-Pin, Male, RoHS; Manufacturer: Samtec; Manufacturer Part Number 1: TSW-103-07-L-S; Pitch: 2.54 mm; ComponentLink3URL: http://www.samtec.com/documents/webfiles/cpdf/TSW-XXX-XX-XXX-X-XX-XXX-MKT.pdf; Temperature Range: -55 to 125 degC; DatasheetVersion: F-214; ComponentLink1Description: Manufacturer URL; ComponentLink2URL: http://www.samtec.com/documents/webfiles/pdf/TSW_TH.PDF; RoHS: True; Orientation: Vertical; ComponentLink2Description: Datasheet; ComponentLink3Description: Package Specification; PackageDescription: .025[0.64] SQ. Post Terminal Strip Assembly; Mounting Technology: Through-hole; PackageVersion: DM, 8/1988; ComponentLink1URL: http://www.samtec.com; PackageReference: *; PartNumber: *; Manufacturer 1: Samtec; Manufacturer 2: Sullins; Manufacturer Part Number 2: PRPC003SAAN-RC; Manufacturer 3: 3M; Manufacturer Part Number 3: 929647-01-03-I
Q6-Q8 = NMOS-2_SOT: as Q4 on sheet 10-Click; Published: 8-Jun-2000; LatestRevisionDate: 17-Jul-2002; LatestRevisionNote: Re-released for DXP Platform.; DatasheetVersion: PD-9.814; PackageVersion: Feb-1997; PackageReference: TO-220AB; Publisher: Altium Limited; PackageDescription: TO, Thru-Hole, Vertical, Heatsink Mounted; 3 In-Line Leads; Pitch 2.54 mm; ComponentLink1Description: Manufacturer Link; ComponentLink1URL: http://www.irf.com/; Manufacturer 2: Rohm; Manufacturer Part Number 2: RUE002N02TL; Manufacturer 3: *; Manufacturer Part Number 3: *
R93 = Res3: as R77 on sheet 11-CPU_GPIO; Published: 8-Jun-2000; LatestRevisionDate: 29-May-2009; LatestRevisionNote: IPC-7351 Footprint Added.; PackageReference: RESC0402-01; Publisher: Altium Limited; PackageDescription: Chip Resistor; Voltage: *; Type: Thick Film; Manufacturer 2: Yageo; Manufacturer Part Number 2: RC0402FR-071K82L; Manufacturer 3: Bourns; Manufacturer Part Number 3: CR0402-FX-1821GLF; PCB_Footprint: RESC0402-01
R94 R103 = Res3: as R51 on sheet 8-SensorsAndJTAG; Published: 8-Jun-2000; LatestRevisionDate: 29-May-2009; LatestRevisionNote: IPC-7351 Footprint Added.; PackageReference: RESC0402-01; Publisher: Altium Limited; PackageDescription: Chip Resistor; Voltage: *; Type: Thick Film; Manufacturer 2: Yageo; Manufacturer Part Number 2: RC0402FR-0720KL; Manufacturer 3: Bourns; Manufacturer Part Number 3: CR0402-FX-2002GLF; PCB_Footprint: RESC0402-01
R95 R97 R98 = Res3: as R49 on sheet 8-SensorsAndJTAG; Published: 8-Jun-2000; LatestRevisionDate: 29-May-2009; LatestRevisionNote: IPC-7351 Footprint Added.; PackageReference: RESC0402-01; Publisher: Altium Limited; PackageDescription: Chip Resistor; Voltage: *; Type: Thick Film; Manufacturer 2: Yageo; Manufacturer Part Number 2: RC0402FR-07100KL; Manufacturer 3: Bourns; Manufacturer Part Number 3: CR0402-FX-1003GLF; PCB_Footprint: RESC0402-01
R96 = Res3: Res,681R,1%,100ppm,0402; Manufacturer 1: Stackpol; Manufacturer Part Number 1: RMCF0402FT681R; Wattage: 63mW; Published: 8-Jun-2000; LatestRevisionDate: 29-May-2009; LatestRevisionNote: IPC-7351 Footprint Added.; PackageReference: RESC0402-01; Publisher: Altium Limited; PackageDescription: Chip Resistor; Voltage: *; Type: Thick Film; Manufacturer 2: Yageo; Manufacturer Part Number 2: RC0402FR-07681RL; Manufacturer 3: Bourns; Manufacturer Part Number 3: CR0402-FX-6810GLF; PCB_Footprint: RESC0402-01
R101 R102 = Res3: Res,0R ohm,Jumper,0402; Manufacturer 1: Stackpol; Manufacturer Part Number 1: RMCF0402ZT0R00; Wattage: 63mW; Tolerance: JMPR; Published: 8-Jun-2000; LatestRevisionDate: 29-May-2009; LatestRevisionNote: IPC-7351 Footprint Added.; PackageReference: RESC0402-01; Publisher: Altium Limited; PackageDescription: Chip Resistor; Voltage: *; Type: Thick Film; Manufacturer 2: Yageo; Manufacturer Part Number 2: RC0402FR-070RL; Manufacturer 3: Panasonic; Manufacturer Part Number 3: ERJ-XGN0R00Y; PCB_Footprint: RESC0402-01
S16 S17 = SolderJumperShorted_Small: as S7 on sheet 8-SensorsAndJTAG; Published: 8-Jun-2000; LatestRevisionDate: 29-May-2009; LatestRevisionNote: IPC-7351 Footprint Added.; PackageReference: J1-0603; Publisher: Altium Limited; PackageDescription: Chip Resistor; Voltage: *; Type: Thick Film; Manufacturer 1: *; Manufacturer Part Number 1: *; Manufacturer 2: *; Manufacturer Part Number 2: *; Manufacturer 3: *; Manufacturer Part Number 3: *; Tolerance: *; Value: *
SW4 = SW_DP3T_CL-SB-23A-01T: Switch, DP3T Slide,8-pin, Vertical, 13mm x 3.6mm x 3.5mm, Actuator 2mm , Tin Contacts,JLead SMT; Manufacturer 1: C&K; Manufacturer Part Number 1: JS203011JCQN; Manufacturer 2: Nidec; Manufacturer Part Number 2: CL-SB-23A-01T
TP58 TP59 = TP_SMPAD: as TP34-TP39 on sheet 9-MIPI
U22 = E7_B0_194BGA: as U22 on sheet 12-JLINK_1

## Sheet 14-Cypress.SchDoc: B1 DevKit (DK-B1)
size 431 x 279 mm; Organization: ORGANIZATION; Address1: ADDRESS 1; Address2: ADDRESS 2; Address3: ADDRESS 3; Address4: ADDRESS 4; DocumentNumber: 10; Revision: -; SheetNumber: 14; SheetTotal: 14; ENG_APP_DATE: --/--/--; DSN_APP_DATE: --/--/--; CHK_APP_DATE: --/--/--
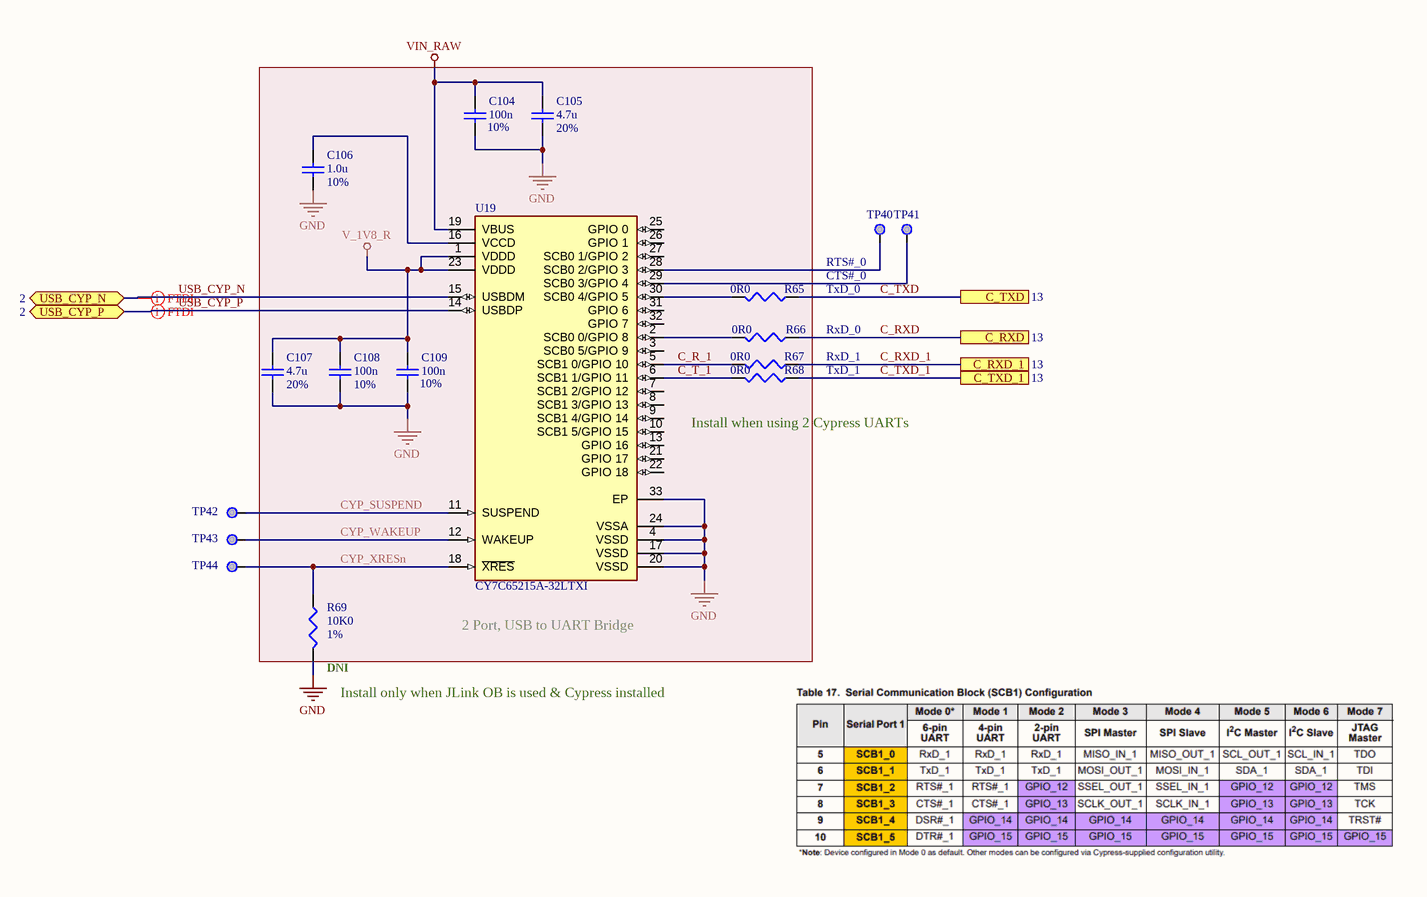
[diagram p13: 14-Cypress.SchDoc]

### Parts
C104  value 100n  Tolerance: 10%  [CAPC0402-01]  (hidden comment: Cap)
C105  value 4.7u  Tolerance: 20%  [CAPC0402-01]  (hidden comment: Cap)
C106  value 1.0u  Tolerance: 10%  [CAPC0402-01]  (hidden comment: Cap)
C107  value 4.7u  Tolerance: 20%  [CAPC0402-01]  (hidden comment: Cap)
C108  value 100n  Tolerance: 10%  [CAPC0402-01]  (hidden comment: Cap)
C109  value 100n  Tolerance: 10%  [CAPC0402-01]  (hidden comment: Cap)
R65  value 0R0  [RESC0402-01]  (hidden comment: Res3)
R66  value 0R0  [RESC0402-01]  (hidden comment: Res3)
R67  value 0R0  [RESC0402-01]  (hidden comment: Res3)
R68  value 0R0  [RESC0402-01]  (hidden comment: Res3)
R69  value 10K0  Tolerance: 1%  [RESC0402-01]  (hidden comment: Res3)
TP40  TP_SMPAD  [TP_50_RND]  (value not drawn)  (no BOM)
TP41  TP_SMPAD  [TP_50_RND]  (value not drawn)  (no BOM)
TP42  TP_SMPAD  [TP_50_RND]  (value not drawn)  (no BOM)
TP43  TP_SMPAD  [TP_50_RND]  (value not drawn)  (no BOM)
TP44  TP_SMPAD  [TP_50_RND]  (value not drawn)  (no BOM)
U19  CY7C65215A-32LTXI  [QFN32_5x5x1-0p5_INF-M_no3D]

### Ports
C_RXD (see 13), C_RXD_1 (see 13), C_TXD (see 13), C_TXD_1 (see 13), USB_CYP_N (bidir, see 2), USB_CYP_P (bidir, see 2)

### Nets
GND: C104.1 C105.1 C106.1 C107.1 C108.1 C109.1 R69.2 U19.4(VSSD) U19.17(VSSD) U19.20(VSSD) U19.24(VSSA) U19.33(EP)
V_1V8_R: C107.2 C108.2 C109.2 U19.1(VDDD) U19.23(VDDD)
VIN_RAW: C104.2 C105.2 U19.19(VBUS)
C_R_1: R67.2 U19.5(SCB1_0/GPIO_10)
C_RXD: R66.1 ; port C_RXD
C_RXD_1: R67.1 ; port C_RXD_1
C_T_1: R68.2 U19.6(SCB1_1/GPIO_11)
C_TXD: R65.1 ; port C_TXD
C_TXD_1: R68.1 ; port C_TXD_1
CYP_SUSPEND: TP42.1 U19.11(SUSPEND)
CYP_WAKEUP: TP43.1 U19.12(WAKEUP)
CYP_XRESn: R69.1 TP44.1 U19.18(~{XRES})
USB_CYP_N: U19.15(USBDM) ; port USB_CYP_N
USB_CYP_P: U19.14(USBDP) ; port USB_CYP_P
NetC106_2: C106.2 U19.16(VCCD)
NetR65_2: R65.2 U19.30(SCB0_4/GPIO_5)
NetR66_2: R66.2 U19.2(SCB0_0/GPIO_8)
NetTP40_1: TP40.1 U19.28(SCB0_2/GPIO_3)
NetTP41_1: TP41.1 U19.29(SCB0_3/GPIO_4)

Not connected (* = marked no-connect by the designer): U19 3(SCB0_5/GPIO_9) 7(SCB1_2/GPIO_12) 8(SCB1_3/GPIO_13) 9(SCB1_4/GPIO_14) 10(SCB1_5/GPIO_15) 13(GPIO_16) 21(GPIO_17) 22(GPIO_18) 25(GPIO_0) 26(GPIO_1) 27(SCB0_1/GPIO_2) 31(GPIO_6) 32(GPIO_7)

### Layout directives
differential pair; differential pair class USB_CYP_: USB_CYP_N, USB_CYP_P

### Notes on the sheet
- RTS#_0
- CTS#_0
- TxD_0
- RxD_0
- RxD_1
- TxD_1
- Install when using 2 Cypress UARTs
- (near U19) 2 Port, USB to UART Bridge
- (near R69) DNI
- (near R69) Install only when JLink OB is used & Cypress installed
- DWG. NO.
- REV
- SHT
- REVISION
- DESCRIPTION
- DATE
- APPROVED
- ENG:
- APPROVALS
- PROJECT
- Suite 300
- Alif Semiconductor
- 7901 Stoneridge Drive
- DSN:
- CHK:
- REFERENCE DOCUMENTS
- TITLE
- Pleasanton, CA 94588  USA
- BOM:
- FAB DWG:
- PCB DWG:
- ASSY DWG:
- SCALE:
- SIZE
- B
- CAGE CODE
- FILE NAME
- DWG NO.
- SHEET
- OF
- none

### Library data of the parts
C104 C108 C109 = Cap: DNI,Cap,100nF,10%,50V,X7R,0402; Manufacturer 1: TDK; Manufacturer Part Number 1: C1005X7R1H104K050BE; PCB_Footprint: CC0402; Published: 8-Jun-2000; LatestRevisionDate: 17-Jul-2002; LatestRevisionNote: Re-released for DXP Platform.; PackageReference: RAD-0.3; Publisher: Altium Limited; PackageDescription: Radial Cap, Thru-Hole; 2 Leads; 0.3 in Pin Spacing; Max_Height: 0.60mm; Manufacturer 2: Samsung; Manufacturer Part Number 2: CL05B104KB54PNC; Manufacturer 3: Walsin; Manufacturer Part Number 3: 0402B104K500CT; Type: X7R; Voltage: 50V
C105 C107 = Cap_225M25VX5R0402_1: DNI,Cap,4.7uF,20%,10V,X5R,0402; Manufacturer 1: TDK; Manufacturer Part Number 1: C1005X5R1A475K050BC; PCB_Footprint: CC0402; Published: 8-Jun-2000; LatestRevisionDate: 17-Jul-2002; LatestRevisionNote: Re-released for DXP Platform.; PackageReference: RAD-0.3; Publisher: Altium Limited; PackageDescription: Radial Cap, Thru-Hole; 2 Leads; 0.3 in Pin Spacing; Max_Height: 0.60mm; Type: X5R; Voltage: 10V; Manufacturer 2: Kyocera; Manufacturer Part Number 2: 0402YD475MAT2A; Manufacturer 3: Samsung; Manufacturer Part Number 3: CL05A475MP5NRNC
C106 = Cap: DNI,Cap,1.0uF,20%,25V,X5R,0402; Manufacturer 1: TDK; Manufacturer Part Number 1: CGB2A1X5R1E105K033BC; PCB_Footprint: CC0402; Published: 8-Jun-2000; LatestRevisionDate: 17-Jul-2002; LatestRevisionNote: Re-released for DXP Platform.; PackageReference: RAD-0.3; Publisher: Altium Limited; PackageDescription: Radial Cap, Thru-Hole; 2 Leads; 0.3 in Pin Spacing; Max_Height: 0.60mm; Manufacturer 2: Yageo; Manufacturer Part Number 2: CC0402KRX5R8BB105; Manufacturer 3: Murata; Manufacturer Part Number 3: GRM155R61E105KA12D; Type: X5R; Voltage: 25V
R65-R68 = Res3: DNI,Res,0R ohm,Jumper,0402; Manufacturer 1: Stackpol; Manufacturer Part Number 1: RMCF0402ZT0R00; Wattage: 63mW; Tolerance: JMPR; Published: 8-Jun-2000; LatestRevisionDate: 29-May-2009; LatestRevisionNote: IPC-7351 Footprint Added.; PackageReference: RESC0402-01; Publisher: Altium Limited; PackageDescription: Chip Resistor; Voltage: *; Type: Thick Film; Manufacturer 2: Yageo; Manufacturer Part Number 2: RC0402FR-070RL; Manufacturer 3: Panasonic; Manufacturer Part Number 3: ERJ-XGN0R00Y; PCB_Footprint: RESC0402-01
R69 = Res3: as R89 on sheet 12-JLINK_1; Published: 8-Jun-2000; LatestRevisionDate: 29-May-2009; LatestRevisionNote: IPC-7351 Footprint Added.; PackageReference: RESC0402-01; Publisher: Altium Limited; PackageDescription: Chip Resistor; Voltage: *; Type: Thick Film; Manufacturer 2: Yageo; Manufacturer Part Number 2: RC0402FR-0710KL; Manufacturer 3: Bourns; Manufacturer Part Number 3: CR0402-FX-1002GLF; PCB_Footprint: RESC0402-01
TP40-TP44 = TP_SMPAD: as TP33 on sheet 8-SensorsAndJTAG
U19 = IC_Dual_USB_UART_Bridge: DNI,IC,Dual USB to Serial Bridge,32QFN; Manufacturer 1: Cypress; Import Ts: 1521861523; Ciiva Ids: 12522558; Interface: I2C,SPI,UART,USB; Min Supply Voltage: 1.71V; Standoff Height: 0mm; Max Supply Voltage: 5.5V; Nominal Supply Current: 13mA; Digikey Description: IC USB TO SERIAL BRIDGE 32QFN; Temperature Range High: +85°C; Category: IC; ComponentLink2Description: Datasheet; Release Date: 1401362620; Manufacturer Part Number 1: CY7C65215A-32LTXI; Octopart: https://octopart.com/cy7c65215-32ltxi-cypress+semiconductor-30243522; Lead Free: Yes; Device Class L2: Interface ICs; RoHS: TRUE; Height: 1mm; Device Class L3: Controllers; Temperature Range Low: -40°C; Ambient Temperature Range High: +85°C; Ipc Land Pattern Name: QFN50P500X500X90-32; Ambient Temperature Range Low: -40°C; Device Class L1: Integrated Circuits (ICs); Package: 001-30999; Mouser Description: USB Interface IC USB-Serial Dual CH Bridge; Temperature: -40°C to +85°C; Automotive: No; ComponentLink2URL: https://www.cypress.com/file/129956/download